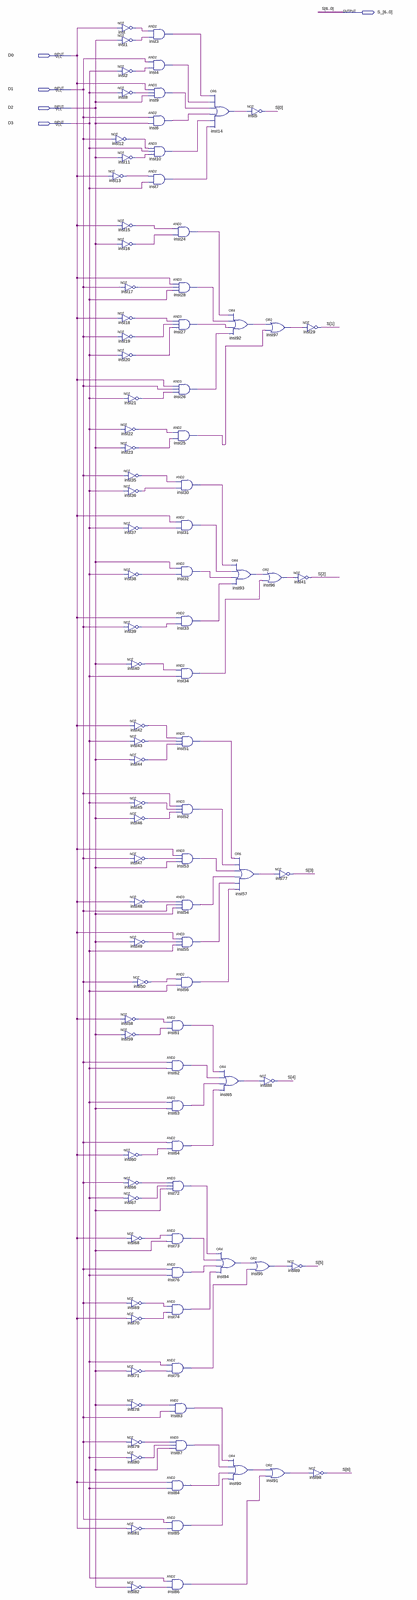
[diagram p0: schematic sheet, whole]
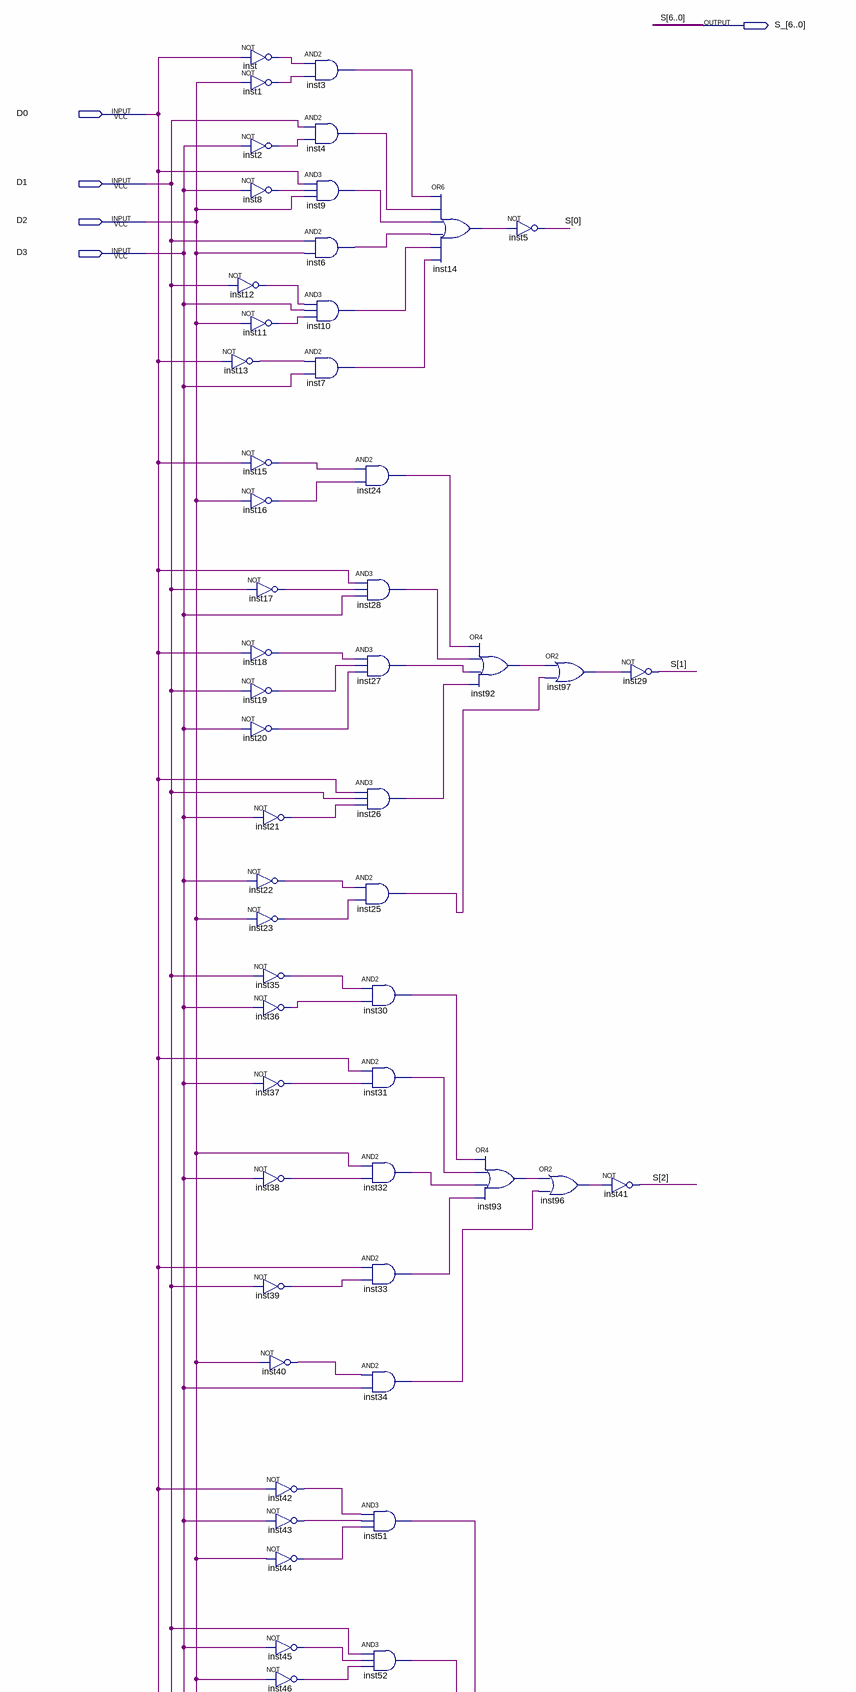
[diagram p1: schematic sheet, upper part]
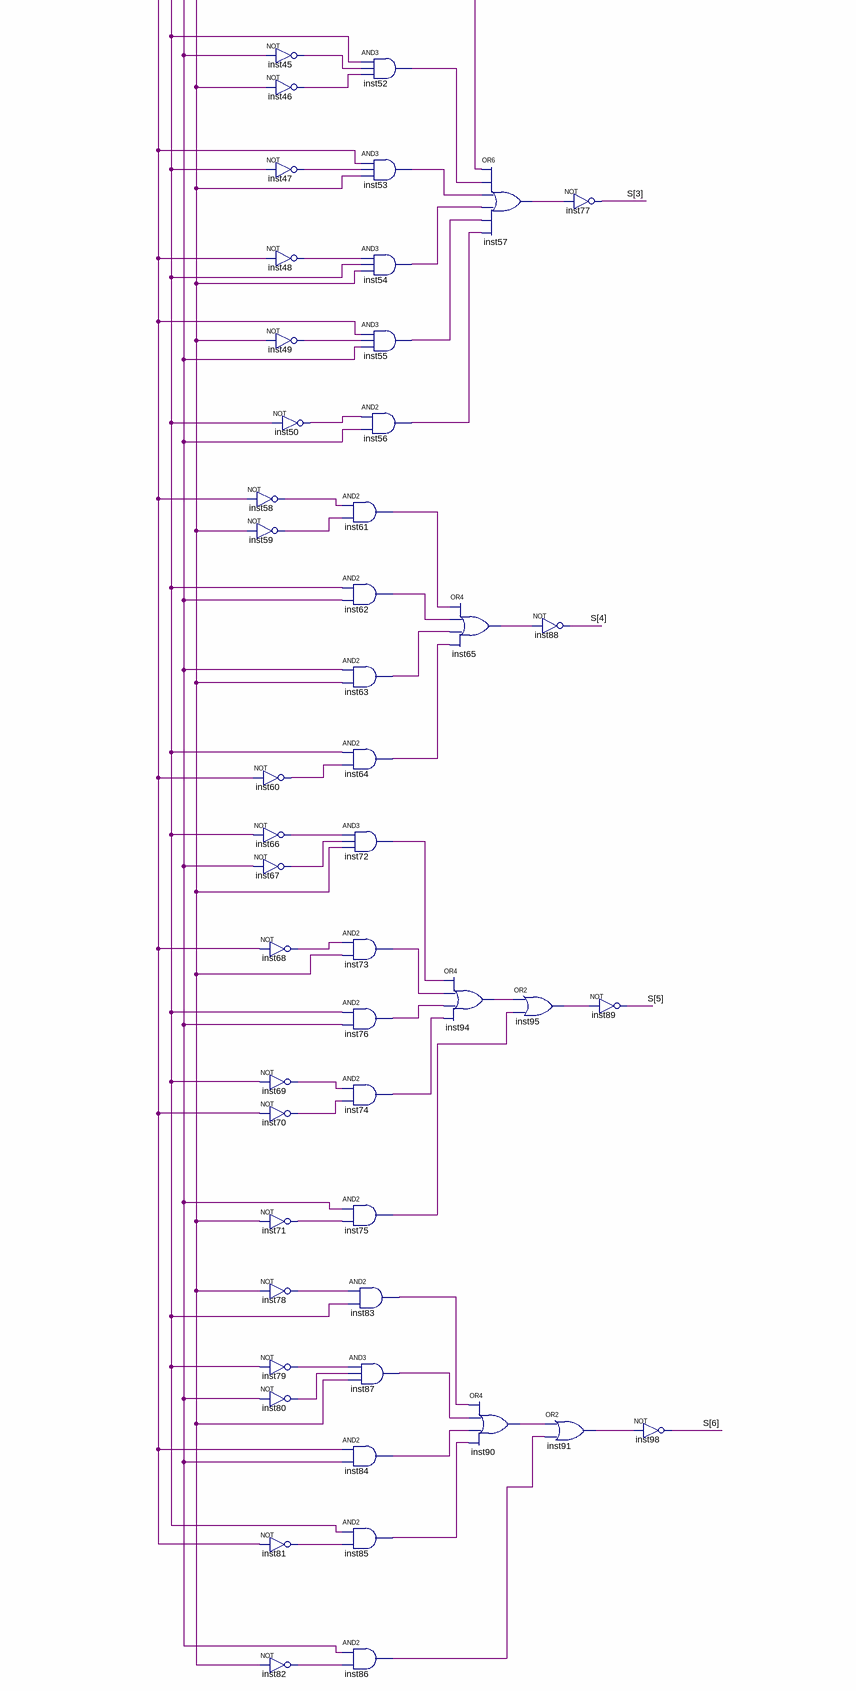
[diagram p2: schematic sheet, lower part]
// Quartus schematic display.bdf as structural Verilog: 99 symbols, 5 pins
module display (
  input  D0,
  input  D1,
  input  D2,
  input  D3,
  output [6:0] S_
);

  wire inst1_out, inst2_out, inst3_out, inst4_out, inst6_out, inst7_out, inst8_out, inst9_out, inst10_out,
       inst11_out, inst12_out, inst13_out, inst14_out, inst15_out, inst16_out, inst17_out, inst18_out,
       inst19_out, inst20_out, inst21_out, inst22_out, inst23_out, inst24_out, inst25_out, inst26_out,
       inst27_out, inst28_out, inst30_out, inst31_out, inst32_out, inst33_out, inst34_out, inst35_out,
       inst36_out, inst37_out, inst38_out, inst39_out, inst40_out, inst42_out, inst43_out, inst44_out,
       inst45_out, inst46_out, inst47_out, inst48_out, inst49_out, inst50_out, inst51_out, inst52_out,
       inst53_out, inst54_out, inst55_out, inst56_out, inst57_out, inst58_out, inst59_out, inst60_out,
       inst61_out, inst62_out, inst63_out, inst64_out, inst65_out, inst66_out, inst67_out, inst68_out,
       inst69_out, inst70_out, inst71_out, inst72_out, inst73_out, inst74_out, inst75_out, inst76_out,
       inst78_out, inst79_out, inst80_out, inst81_out, inst82_out, inst83_out, inst84_out, inst85_out,
       inst86_out, inst87_out, inst90_out, inst91_out, inst92_out, inst93_out, inst94_out, inst95_out,
       inst96_out, inst97_out, inst_out;

  not inst (inst_out, D0);
  not inst1 (inst1_out, D2);
  not inst2 (inst2_out, D3);
  not inst8 (inst8_out, D3);
  not inst12 (inst12_out, D1);
  not inst11 (inst11_out, D2);
  not inst13 (inst13_out, D0);
  not inst15 (inst15_out, D0);
  not inst16 (inst16_out, D2);
  not inst17 (inst17_out, D1);
  not inst18 (inst18_out, D0);
  not inst19 (inst19_out, D1);
  not inst20 (inst20_out, D3);
  not inst21 (inst21_out, D3);
  not inst22 (inst22_out, D3);
  not inst23 (inst23_out, D2);
  not inst35 (inst35_out, D1);
  not inst36 (inst36_out, D3);
  not inst37 (inst37_out, D3);
  not inst38 (inst38_out, D3);
  not inst39 (inst39_out, D1);
  not inst40 (inst40_out, D2);
  not inst58 (inst58_out, D0);
  not inst59 (inst59_out, D2);
  not inst60 (inst60_out, D0);
  not inst66 (inst66_out, D1);
  not inst67 (inst67_out, D3);
  not inst68 (inst68_out, D0);
  not inst69 (inst69_out, D1);
  not inst70 (inst70_out, D0);
  not inst71 (inst71_out, D2);
  not inst78 (inst78_out, D2);
  not inst79 (inst79_out, D1);
  not inst80 (inst80_out, D3);
  not inst81 (inst81_out, D0);
  not inst82 (inst82_out, D2);
  and inst3 (inst3_out, inst_out, inst1_out);
  and inst4 (inst4_out, D1, inst2_out);
  and inst9 (inst9_out, D0, inst8_out, D2);
  and inst6 (inst6_out, D1, D2);
  and inst10 (inst10_out, inst12_out, D3, inst11_out);
  and inst7 (inst7_out, inst13_out, D3);
  not inst42 (inst42_out, D0);
  not inst43 (inst43_out, D3);
  not inst44 (inst44_out, D2);
  not inst45 (inst45_out, D3);
  not inst46 (inst46_out, D2);
  not inst47 (inst47_out, D1);
  not inst48 (inst48_out, D0);
  not inst49 (inst49_out, D2);
  not inst50 (inst50_out, D1);
  and inst24 (inst24_out, inst15_out, inst16_out);
  and inst28 (inst28_out, D0, inst17_out, D3);
  and inst27 (inst27_out, inst18_out, inst19_out, inst20_out);
  and inst26 (inst26_out, D0, D1, inst21_out);
  and inst25 (inst25_out, inst22_out, inst23_out);
  and inst30 (inst30_out, inst35_out, inst36_out);
  and inst31 (inst31_out, D0, inst37_out);
  and inst32 (inst32_out, D2, inst38_out);
  and inst33 (inst33_out, D0, inst39_out);
  and inst34 (inst34_out, inst40_out, D3);
  and inst51 (inst51_out, inst42_out, inst43_out, inst44_out);
  and inst52 (inst52_out, D1, inst45_out, inst46_out);
  and inst53 (inst53_out, D0, inst47_out, D2);
  and inst54 (inst54_out, inst48_out, D1, D2);
  and inst55 (inst55_out, D0, inst49_out, D3);
  and inst56 (inst56_out, inst50_out, D3);
  and inst61 (inst61_out, inst58_out, inst59_out);
  and inst62 (inst62_out, D1, D3);
  and inst63 (inst63_out, D3, D2);
  and inst64 (inst64_out, D1, inst60_out);
  and inst72 (inst72_out, inst66_out, inst67_out, D2);
  and inst73 (inst73_out, inst68_out, D2);
  and inst76 (inst76_out, D1, D3);
  and inst74 (inst74_out, inst69_out, inst70_out);
  and inst75 (inst75_out, D3, inst71_out);
  and inst83 (inst83_out, inst78_out, D1);
  and inst87 (inst87_out, inst79_out, inst80_out, D2);
  and inst84 (inst84_out, D0, D3);
  and inst85 (inst85_out, D1, inst81_out);
  and inst86 (inst86_out, D3, inst82_out);
  or inst14 (inst14_out, inst3_out, inst4_out, inst9_out, inst6_out, inst10_out, inst7_out);
  or inst65 (inst65_out, inst61_out, inst62_out, inst63_out, inst64_out);
  or inst94 (inst94_out, inst72_out, inst73_out, inst76_out, inst74_out);
  not inst5 (S_[0], inst14_out);
  or inst92 (inst92_out, inst24_out, inst28_out, inst27_out, inst26_out);
  or inst93 (inst93_out, inst30_out, inst31_out, inst32_out, inst33_out);
  or inst57 (inst57_out, inst51_out, inst52_out, inst53_out, inst54_out, inst55_out, inst56_out);
  or inst95 (inst95_out, inst94_out, inst75_out);
  or inst90 (inst90_out, inst83_out, inst87_out, inst84_out, inst85_out);
  or inst97 (inst97_out, inst92_out, inst25_out);
  or inst96 (inst96_out, inst93_out, inst34_out);
  not inst77 (S_[3], inst57_out);
  not inst88 (S_[4], inst65_out);
  or inst91 (inst91_out, inst90_out, inst86_out);
  not inst41 (S_[2], inst96_out);
  not inst89 (S_[5], inst95_out);
  not inst29 (S_[1], inst97_out);
  not inst98 (S_[6], inst91_out);

  // Other names for the same wires on the sheet: S[6:0] = S_
endmodule
